# Altium schematic sheet Page04 CPU PWR.SchDoc
size 513 x 386 mm
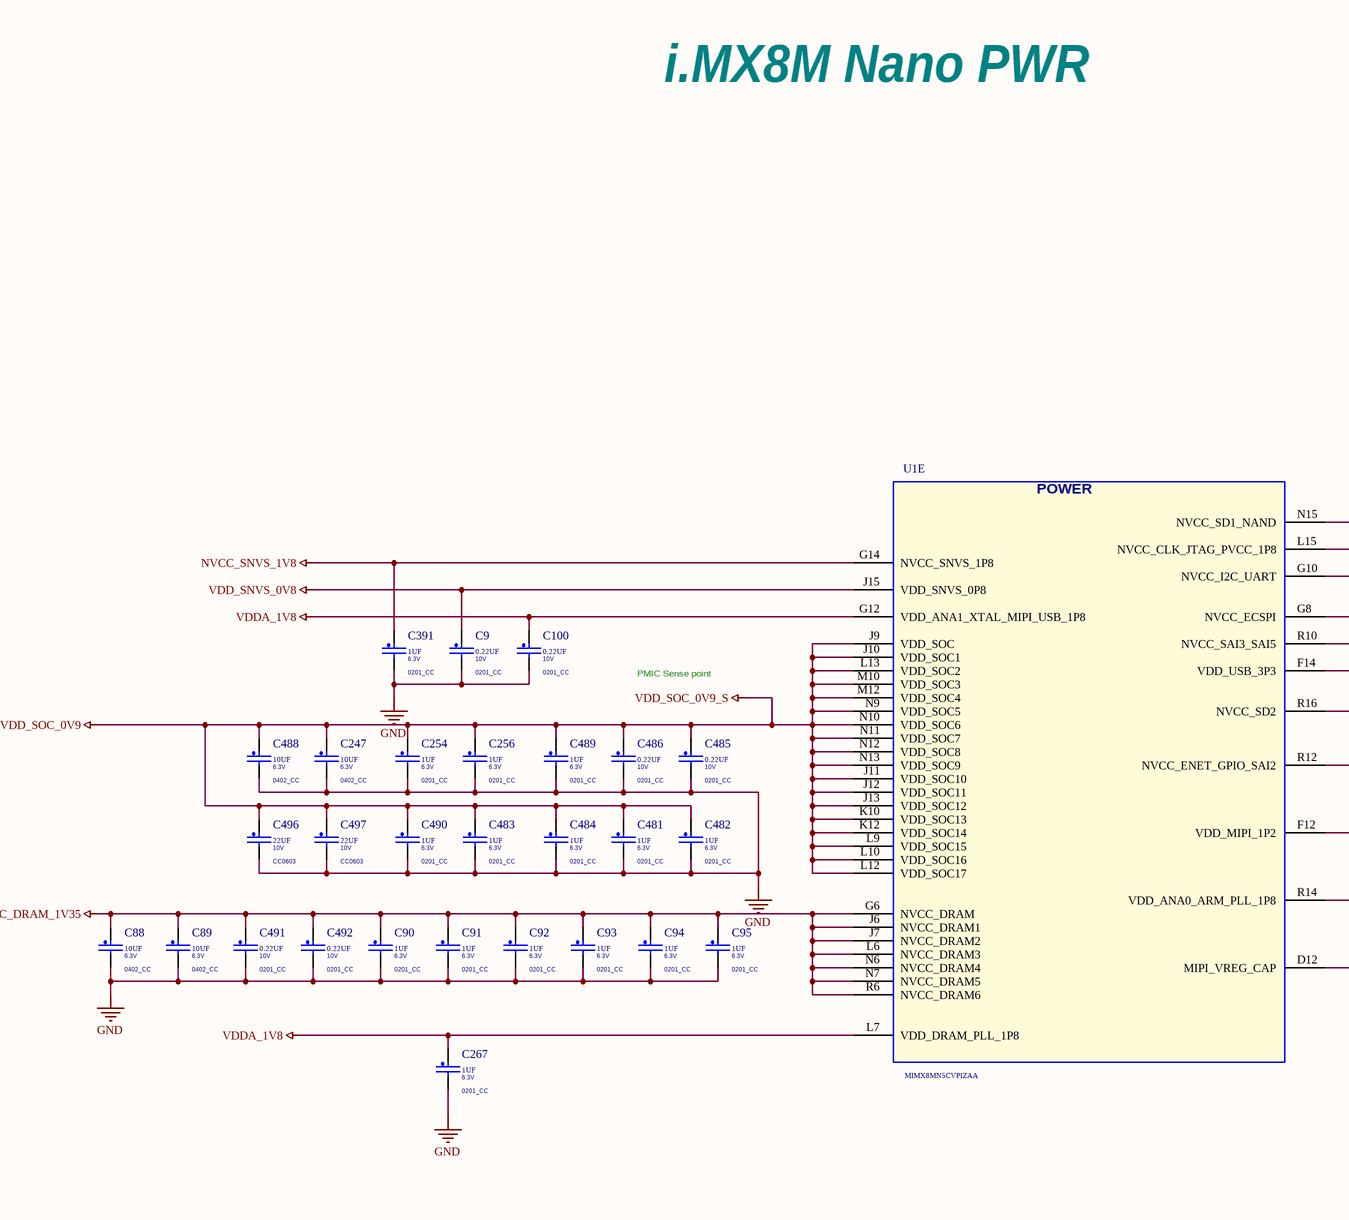
[diagram p0: Page04 CPU PWR.SchDoc, left]
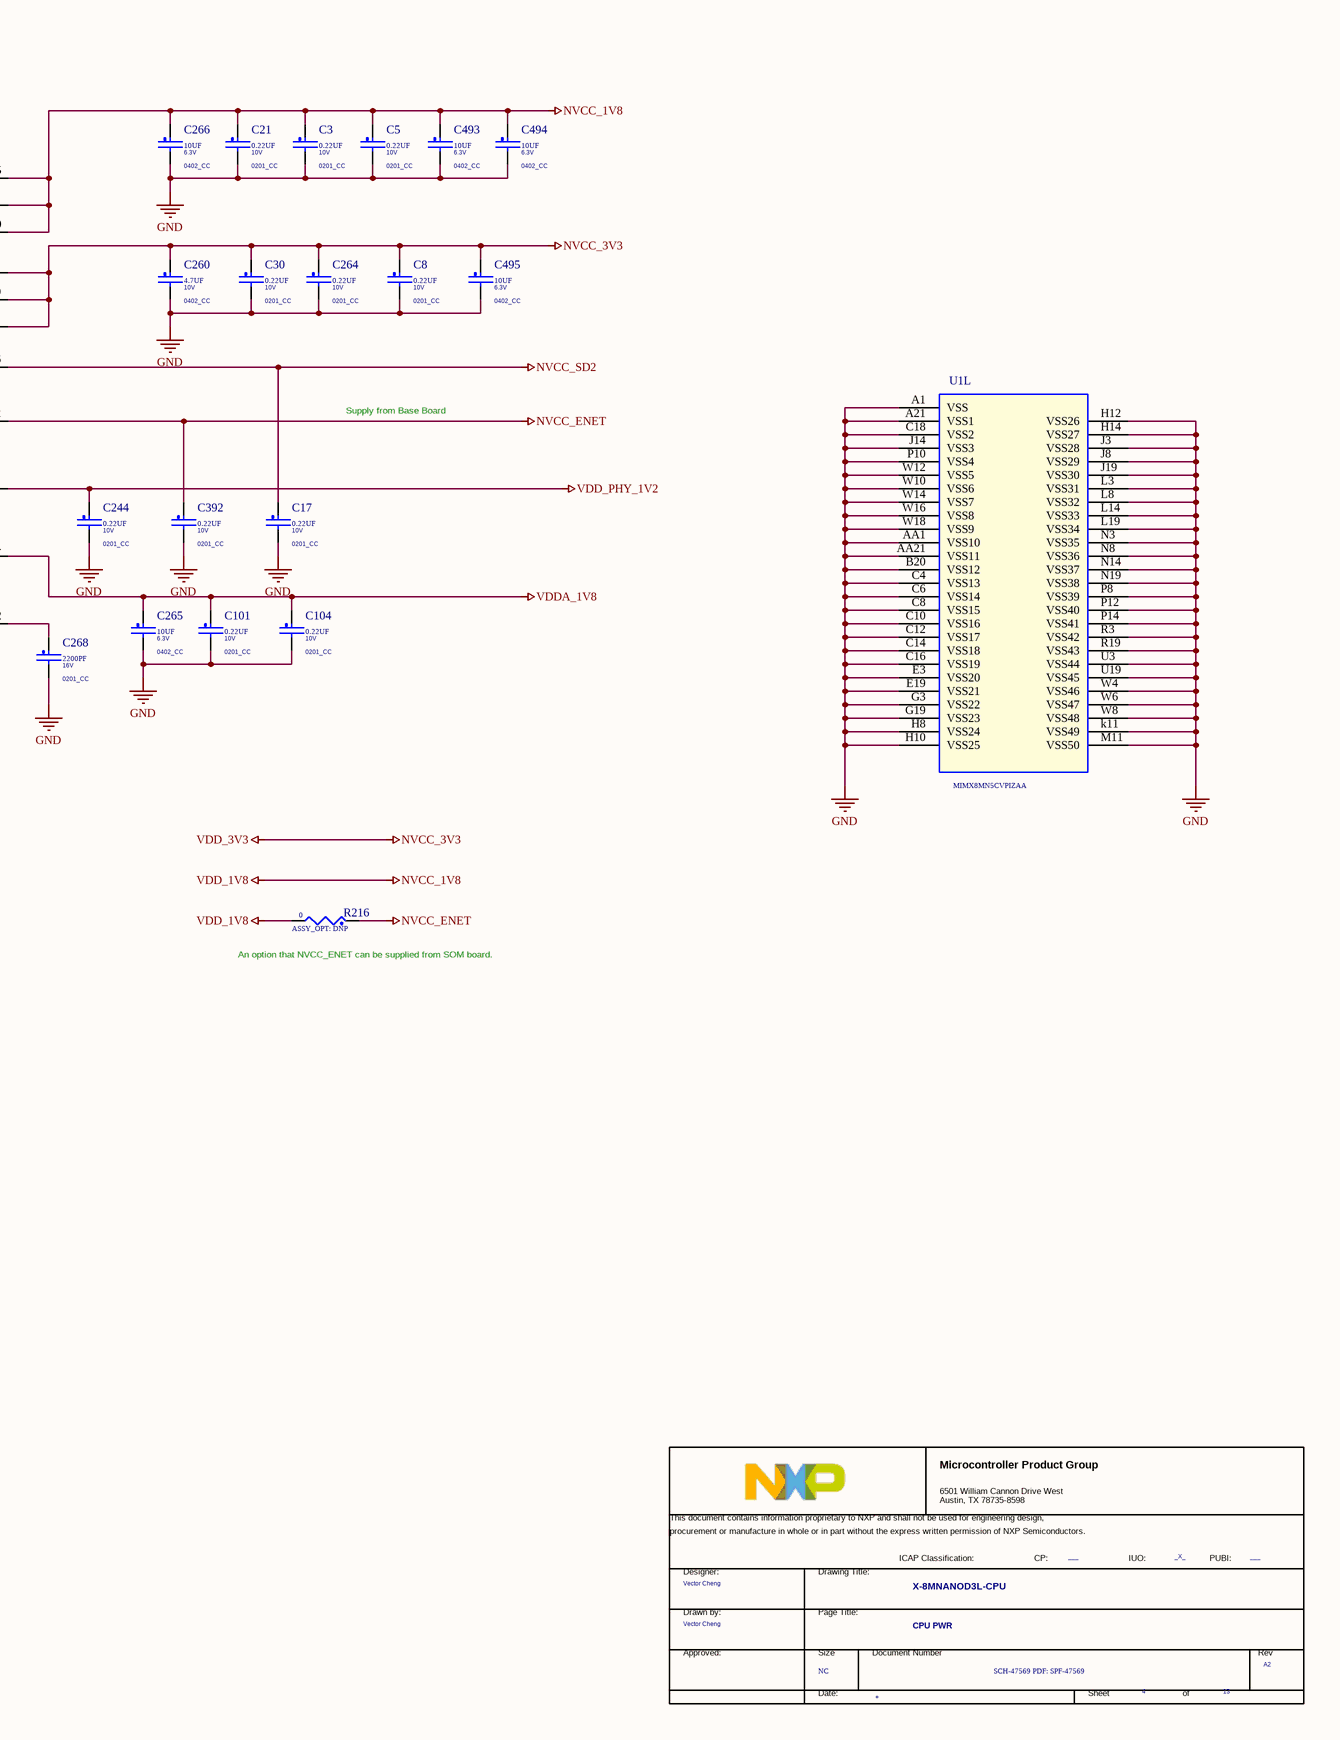
[diagram p1: Page04 CPU PWR.SchDoc, right]

## Parts
*  FCP: ___  FIUO: _X_  DrawnBy: Vector Cheng  PageTitle: CPU PWR  Page Count: 13  Page Number: 4  Page Size: NC  Title: X-8MNANOD3L-CPU  RevCode: A2  Doc: SCH-47569 PDF: SPF-47569  (hidden comment: TitleBlock_MCPG)  (graphical)
C3  0.22UF  VOLTAGE: 10V  PCB Footprint: 0201_CC  [0201_CC - C]
C5  0.22UF  VOLTAGE: 10V  PCB Footprint: 0201_CC  [0201_CC - C]
C8  0.22UF  VOLTAGE: 10V  PCB Footprint: 0201_CC  [0201_CC - C]
C9  0.22UF  VOLTAGE: 10V  PCB Footprint: 0201_CC  [0201_CC - C]
C17  0.22UF  VOLTAGE: 10V  PCB Footprint: 0201_CC  [0201_CC - C]
C21  0.22UF  VOLTAGE: 10V  PCB Footprint: 0201_CC  [0201_CC - C]
C30  0.22UF  VOLTAGE: 10V  PCB Footprint: 0201_CC  [0201_CC - C]
C88  10UF  PCB Footprint: 0402_CC  VOLTAGE: 6.3V  [0402_CC - C]
C89  10UF  PCB Footprint: 0402_CC  VOLTAGE: 6.3V  [0402_CC - C]
C90  1UF  PCB Footprint: 0201_CC  VOLTAGE: 6.3V  [0201_CC - C]
C91  1UF  PCB Footprint: 0201_CC  VOLTAGE: 6.3V  [0201_CC - C]
C92  1UF  PCB Footprint: 0201_CC  VOLTAGE: 6.3V  [0201_CC - C]
C93  1UF  PCB Footprint: 0201_CC  VOLTAGE: 6.3V  [0201_CC - C]
C94  1UF  PCB Footprint: 0201_CC  VOLTAGE: 6.3V  [0201_CC - C]
C95  1UF  PCB Footprint: 0201_CC  VOLTAGE: 6.3V  [0201_CC - C]
C100  0.22UF  VOLTAGE: 10V  PCB Footprint: 0201_CC  [0201_CC - C]
C101  0.22UF  VOLTAGE: 10V  PCB Footprint: 0201_CC  [0201_CC - C]
C104  0.22UF  VOLTAGE: 10V  PCB Footprint: 0201_CC  [0201_CC - C]
C244  0.22UF  VOLTAGE: 10V  PCB Footprint: 0201_CC  [0201_CC - C]
C247  10UF  VOLTAGE: 6.3V  PCB Footprint: 0402_CC  [0402_CC - C]
C254  1UF  VOLTAGE: 6.3V  PCB Footprint: 0201_CC  [0201_CC - C]
C256  1UF  VOLTAGE: 6.3V  PCB Footprint: 0201_CC  [0201_CC - C]
C260  4.7UF  VOLTAGE: 10V  PCB Footprint: 0402_CC  [0402_CC - C]
C264  0.22UF  VOLTAGE: 10V  PCB Footprint: 0201_CC  [0201_CC - C]
C265  10UF  VOLTAGE: 6.3V  PCB Footprint: 0402_CC  [0402_CC - C]
C266  10UF  VOLTAGE: 6.3V  PCB Footprint: 0402_CC  [0402_CC - C]
C267  1UF  VOLTAGE: 6.3V  PCB Footprint: 0201_CC  [0201_CC - C]
C268  2200PF  VOLTAGE: 16V  PCB Footprint: 0201_CC  [0201_CC - C]
C391  1UF  VOLTAGE: 6.3V  PCB Footprint: 0201_CC  [0201_CC - C]
C392  0.22UF  VOLTAGE: 10V  PCB Footprint: 0201_CC  [0201_CC - C]
C481  1UF  VOLTAGE: 6.3V  PCB Footprint: 0201_CC  [0201_CC - C]
C482  1UF  VOLTAGE: 6.3V  PCB Footprint: 0201_CC  [0201_CC - C]
C483  1UF  VOLTAGE: 6.3V  PCB Footprint: 0201_CC  [0201_CC - C]
C484  1UF  VOLTAGE: 6.3V  PCB Footprint: 0201_CC  [0201_CC - C]
C485  0.22UF  VOLTAGE: 10V  PCB Footprint: 0201_CC  [0201_CC - C]
C486  0.22UF  VOLTAGE: 10V  PCB Footprint: 0201_CC  [0201_CC - C]
C488  10UF  VOLTAGE: 6.3V  PCB Footprint: 0402_CC  [0402_CC - C]
C489  1UF  VOLTAGE: 6.3V  PCB Footprint: 0201_CC  [0201_CC - C]
C490  1UF  VOLTAGE: 6.3V  PCB Footprint: 0201_CC  [0201_CC - C]
C491  0.22UF  PCB Footprint: 0201_CC  VOLTAGE: 10V  [0201_CC - C]
C492  0.22UF  PCB Footprint: 0201_CC  VOLTAGE: 10V  [0201_CC - C]
C493  10UF  VOLTAGE: 6.3V  PCB Footprint: 0402_CC  [0402_CC - C]
C494  10UF  VOLTAGE: 6.3V  PCB Footprint: 0402_CC  [0402_CC - C]
C495  10UF  VOLTAGE: 6.3V  PCB Footprint: 0402_CC  [0402_CC - C]
C496  22UF  VOLTAGE: 10V  PCB Footprint: CC0603  [0603_CC]
C497  22UF  VOLTAGE: 10V  PCB Footprint: CC0603  [0603_CC]
R216  0  ASSY_OPT: DNP  [0402_CC]
U1  MIMX8MN5CVPIZAA  [BGA306C50P21X21_1100X1100X101]  (parts E,L of 12)

## Nets
GND: C3.2 C5.2 C8.2 C9.2 C17.2 C21.2 C30.2 C88.2 C89.2 C90.2 C91.2 C92.2 C93.2 C94.2 C95.2 C100.2 C101.2 C104.2 C244.2 C247.2 C254.2 C256.2 C260.2 C264.2 C265.2 C266.2 C267.2 C268.2 C391.2 C392.2 C481.2 C482.2 C483.2 C484.2 C485.2 C486.2 C488.2 C489.2 C490.2 C491.2 C492.2 C493.2 C494.2 C495.2 C496.2 C497.2 U1.A1(VSS) U1.A21(VSS1) U1.AA1(VSS10) U1.AA21(VSS11) U1.B20(VSS12) U1.C4(VSS13) U1.C6(VSS14) U1.C8(VSS15) U1.C10(VSS16) U1.C12(VSS17) U1.C14(VSS18) U1.C16(VSS19) U1.C18(VSS2) U1.E3(VSS20) U1.E19(VSS21) U1.G3(VSS22) U1.G19(VSS23) U1.H8(VSS24) U1.H10(VSS25) U1.H12(VSS26) U1.H14(VSS27) U1.J3(VSS28) U1.J8(VSS29) U1.J14(VSS3) U1.J19(VSS30) U1.k11(VSS49) U1.L3(VSS31) U1.L8(VSS32) U1.L14(VSS33) U1.L19(VSS34) U1.M11(VSS50) U1.N3(VSS35) U1.N8(VSS36) U1.N14(VSS37) U1.N19(VSS38) U1.P8(VSS39) U1.P10(VSS4) U1.P12(VSS40) U1.P14(VSS41) U1.R3(VSS42) U1.R19(VSS43) U1.U3(VSS44) U1.U19(VSS45) U1.W4(VSS46) U1.W6(VSS47) U1.W8(VSS48) U1.W10(VSS6) U1.W12(VSS5) U1.W14(VSS7) U1.W16(VSS8) U1.W18(VSS9)
NVCC_1V8: C3.1 C5.1 C21.1 C266.1 C493.1 C494.1 R216.2 U1.G10(NVCC_I2C_UART) U1.L15(NVCC_CLK_JTAG_PVCC_1P8) U1.N15(NVCC_SD1_NAND)  [also labelled VDD_1V8]
NVCC_3V3: C8.1 C30.1 C260.1 C264.1 C495.1 U1.F14(VDD_USB_3P3) U1.G8(NVCC_ECSPI) U1.R10(NVCC_SAI3_SAI5)  [also labelled VDD_3V3]
NVCC_DRAM_1V35: C88.1 C89.1 C90.1 C91.1 C92.1 C93.1 C94.1 C95.1 C491.1 C492.1 U1.G6(NVCC_DRAM) U1.J6(NVCC_DRAM1) U1.J7(NVCC_DRAM2) U1.L6(NVCC_DRAM3) U1.N6(NVCC_DRAM4) U1.N7(NVCC_DRAM5) U1.R6(NVCC_DRAM6)
NVCC_ENET: C392.1 R216.1 U1.R12(NVCC_ENET_GPIO_SAI2)
NVCC_SD2: C17.1 U1.R16(NVCC_SD2)
NVCC_SNVS_1V8: C391.1 U1.G14(NVCC_SNVS_1P8)
VDD_PHY_1V2: C244.1 U1.F12(VDD_MIPI_1P2)
VDD_SNVS_0V8: C9.1 U1.J15(VDD_SNVS_0P8)
VDD_SOC_0V9: C247.1 C254.1 C256.1 C481.1 C482.1 C483.1 C484.1 C485.1 C486.1 C488.1 C489.1 C490.1 C496.1 C497.1 U1.J9(VDD_SOC) U1.J10(VDD_SOC1) U1.J11(VDD_SOC10) U1.J12(VDD_SOC11) U1.J13(VDD_SOC12) U1.K10(VDD_SOC13) U1.K12(VDD_SOC14) U1.L9(VDD_SOC15) U1.L10(VDD_SOC16) U1.L12(VDD_SOC17) U1.L13(VDD_SOC2) U1.M10(VDD_SOC3) U1.M12(VDD_SOC4) U1.N9(VDD_SOC5) U1.N10(VDD_SOC6) U1.N11(VDD_SOC7) U1.N12(VDD_SOC8) U1.N13(VDD_SOC9)  [also labelled VDD_SOC_0V9_S]
VDDA_1V8: C100.1 C101.1 C104.1 C265.1 C267.1 U1.G12(VDD_ANA1_XTAL_MIPI_USB_1P8) U1.L7(VDD_DRAM_PLL_1P8) U1.R14(VDD_ANA0_ARM_PLL_1P8)
NetC268_1: C268.1 U1.D12(MIPI_VREG_CAP)

## Notes on the sheet
- i.MX8M Nano PWR
- PMIC Sense point
- Supply from Base Board
- (near R216) An option that NVCC_ENET can be supplied from SOM board.
- (in symbol MIMX8MN, part E) POWER
- (in symbol TitleBlock_MCPG) Microcontroller Product Group; 6501 William Cannon Drive West / Austin, TX 78735-8598; This document contains information proprietary to NXP and shall not be used for engineering design,; procurement or manufacture in whole or in part without the express written permission of NXP Semiconductors.; ICAP Classification:; CP:; IUO:; PUBI:; Designer:; Drawing Title:; Drawn by:; Page Title:; Approved:; Size; Document Number; Rev; Date:; Sheet; of

## Library data of the parts
* = TitleBlock_MCPG: OrgAddr1: NO. 192 Liangjing Rd. Pudong New Area, ShangHai; OrgName: NXP Semiconductor; PUBI: ___; Designer: Vector Cheng; Page Create Date: March  8, 1995; Page Modify Date: *
C3 C9 C104 C392 C485 C486 = CAP_NP: CAP CER 0.22UF 10V 20% X5R 0201; CLASS: DISCRETE; FPLIST: CC0201,CC0201_HD,0201_CC; CAD_APPROVED: Yes; MFG_PN01: LMK063BJ224MP-F; MFG_NAME01: Taiyo Yuden; AGILE_PN: 150-78815; HEIGHT: 0.33MM; ROHS: Yes; Tolerance: 20%
C5 C8 C17 C21 C100 C101 C264 C491 C492 = CAP_NP: CAP CER 0.22UF 10V 20% X5R 0201; CLASS: DISCRETE; AGILE_PN: 150-78815; MFG_NAME01: Taiyo Yuden; MFG_PN01: LMK063BJ224MP-F; CAD_APPROVED: Yes; FPLIST: CC0201,CC0201_HD,0201_CC; Tolerance: 20%; ROHS: Yes; HEIGHT: 0.33MM
C30 = CAP_NP: CAP CER 0.22UF 10V 20% X5R 0201; CLASS: DISCRETE; FPLIST: CC0201,CC0201_HD,0201_CC,0201_CC_012SM_NSP; CAD_APPROVED: Yes; MFG_PN01: LMK063BJ224MP-F; MFG_NAME01: Taiyo Yuden; AGILE_PN: 150-78815; HEIGHT: 0.33MM; ROHS: Yes; Tolerance: 20%
C88 C265 C266 C493 C494 = CAP_NP: CAP CER 10UF 6.3V 20% X5R 0402; CLASS: DISCRETE; AGILE_PN: 150-79163; MFG_NAME01: SAMSUNG ELECTRO MECHANICS; MFG_PN01: CL05A106MQ5NUNC; CAD_APPROVED: Yes; FPLIST: CC0402_25,CC0402_HD,0402_CC; Tolerance: 20%; ROHS: Yes; HEIGHT: 0.65 MM
C89 C247 C488 C495 = CAP_NP: CAP CER 10UF 6.3V 20% X5R 0402; CLASS: DISCRETE; FPLIST: CC0402_25,CC0402_HD,0402_CC; CAD_APPROVED: Yes; MFG_PN01: CL05A106MQ5NUNC; MFG_NAME01: SAMSUNG ELECTRO MECHANICS; AGILE_PN: 150-79163; HEIGHT: 0.65 MM; ROHS: Yes; Tolerance: 20%
C90-C92 C95 C254 C391 C481-C484 C489 C490 = CAP_NP: CAP CER 1uF 6.3V 20% X5R 0201; CLASS: DISCRETE; FPLIST: CC0201,CC0201_HD,0201_CC,0201_CC_012SM_NSP; CAD_APPROVED: Yes; MFG_PN01: 02016D105MAT2A; MFG_NAME01: AVX; AGILE_PN: 150-79407; Package Type: 7¡± reel; Package Size: 0201; HEIGHT: 0.35MM; ROHS: Yes; Tolerance: 20%
C93 C94 C256 C267 = CAP_NP: CAP CER 1uF 6.3V 20% X5R 0201; CLASS: DISCRETE; AGILE_PN: 150-79407; MFG_NAME01: AVX; MFG_PN01: 02016D105MAT2A; CAD_APPROVED: Yes; FPLIST: CC0201,CC0201_HD,0201_CC,0201_CC_012SM_NSP; Package Type: 7¡± reel; Package Size: 0201; Tolerance: 20%; ROHS: Yes; HEIGHT: 0.35MM
C244 = CAP_NP: CAP CER 0.22UF 10V 20% X5R 0201; CLASS: DISCRETE; FPLIST: CC0201,CC0201_HD,0201_CC,CC_0201_CIR,0201_CC_012SM_NSP; CAD_APPROVED: Yes; MFG_PN01: LMK063BJ224MP-F; MFG_NAME01: Taiyo Yuden; AGILE_PN: 150-78815; HEIGHT: 0.33MM; ROHS: Yes; Tolerance: 20%
C260 = CAP_NP: CAP CER 4.7uF 10V 10% X5R 0402; CLASS: DISCRETE; AGILE_PN: 150-80044; MFG_NAME01: Samsung Electro Mechanics; MFG_PN01: CL05A475KP5NRNC; CAD_APPROVED: Yes; FPLIST: CC0402_25,CC0402_HD,0402_CC; Tolerance: 10%; ROHS: Yes; HEIGHT: 0.65MM
C268 = CAP_NP: CAP CER 2200PF 16V 10% X7R 0201; CLASS: DISCRETE; AGILE_PN: 150-78660; Tolerance: 20%; MFG_NAME01: MURATA; MFG_PN01: GRM033R71C222KA88D; CAD_APPROVED: Yes; FPLIST: CC0201,CC0201_HD,0201_CC; ROHS: Yes; HEIGHT: 0.33 MM
C496 C497 = CAP_NP: CAP CER 22uF 10V 20% X5R 0603; CLASS: DISCRETE; WVDC: 6.3V; AGILE_PN: 150-79530; MFG_NAME01: TDK; MFG_PN01: C1608X5R1A226M080AC; CAD_APPROVED: Yes; FPLIST: CC0603_OV,CC0603,0603_CC; SIGNAL_MODEL: DEFAULT_CAPACITOR_2.2e+07pF_2_1; Package Size: 0603; Tolerance: 20%; ROHS: Yes; HEIGHT: 1MM
R216 = RES: RES MF ZERO OHM 1/16W 5% 0402; CLASS: DISCRETE; AGILE_PN: 470-75394; MFG_NAME01: YAGEO AMERICA; MFG_PN01: RC0402JR-070RL; CAD_APPROVED: Yes; FPLIST: RC0402_25,RC0402_HD,RC0402_X2,0402_CC; Tolerance: 5%; ROHS: Yes; HEIGHT: 0.45 MM; VOLTAGE: 1/16W; PCB Footprint: 0402_CC
U1 = MIMX8MN: IC CPU QUAD CORTEX A53+M7 1.4GHZ -- BGA306; PCB Footprint: pbga306_0p5_sq11mm; AGILE_PN: TMP-CIP-5098; CAD_APPROVED: Yes; PRE_APN: 330-77152; Temp Range: -40¡ãC to 105¡ãC; MFG_NAME01: NXP SEMICONDUCTORS; CLASS: IC; HEIGHT: 1.01MM; ROHS: Yes; MFG_PN01: MIMX8MN5CVPIZAA